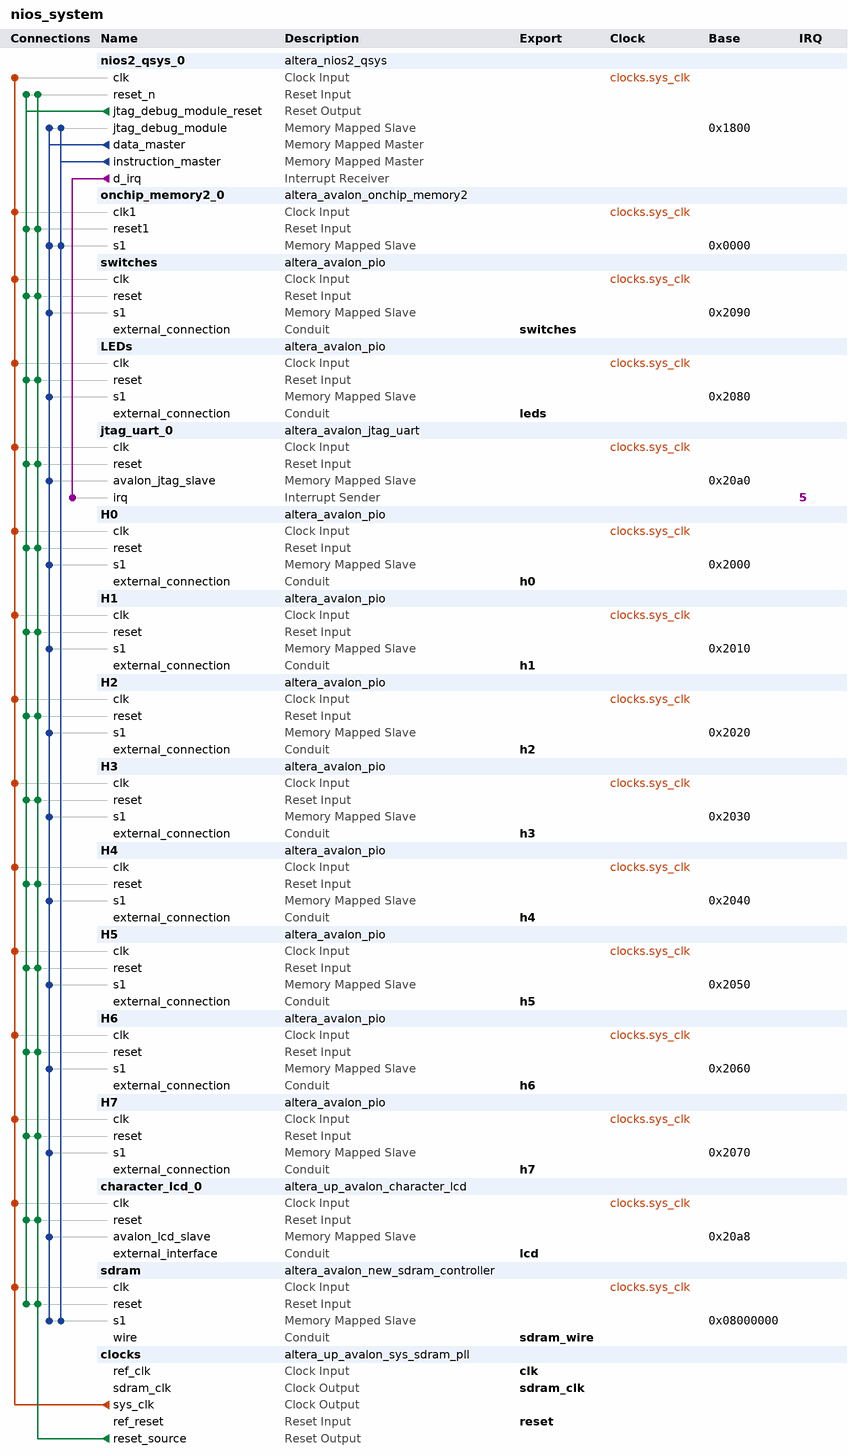
[diagram p0: system contents]
# Platform Designer (Qsys) system nios_system, Cyclone IV E EP4CE115F29C7
# Parameters at their usual value, and those the tool derives, are not listed.
package require -exact qsys 18.0
create_system nios_system
set_project_property DEVICE_FAMILY {Cyclone IV E}
set_project_property DEVICE EP4CE115F29C7

add_instance nios2_qsys_0 altera_nios2_qsys 16.1
set_instance_parameter_value nios2_qsys_0 breakSlave nios2_qsys_0.jtag_debug_module
set_instance_parameter_value nios2_qsys_0 exceptionSlave sdram.s1
set_instance_parameter_value nios2_qsys_0 icache_size 4096
set_instance_parameter_value nios2_qsys_0 impl Fast
set_instance_parameter_value nios2_qsys_0 mmu_TLBMissExcSlave None
set_instance_parameter_value nios2_qsys_0 muldiv_divider true
set_instance_parameter_value nios2_qsys_0 resetSlave sdram.s1
set_instance_parameter_value nios2_qsys_0 resetrequest_enabled true

add_instance onchip_memory2_0 altera_avalon_onchip_memory2 18.0
set_instance_parameter_value onchip_memory2_0 dataWidth 32
set_instance_parameter_value onchip_memory2_0 dualPort false
set_instance_parameter_value onchip_memory2_0 initMemContent true
set_instance_parameter_value onchip_memory2_0 initializationFileName onchip_mem.hex
set_instance_parameter_value onchip_memory2_0 memorySize 4096

add_instance switches altera_avalon_pio 18.0
set_instance_parameter_value switches direction Input
set_instance_parameter_value switches simDoTestBenchWiring true
set_instance_parameter_value switches width 8

add_instance LEDs altera_avalon_pio 18.0
set_instance_parameter_value LEDs direction Output
set_instance_parameter_value LEDs width 8

add_instance jtag_uart_0 altera_avalon_jtag_uart 18.0
set_instance_parameter_value jtag_uart_0 simInteractiveOptions NO_INTERACTIVE_WINDOWS

add_instance H0 altera_avalon_pio 18.0
set_instance_parameter_value H0 direction Output
set_instance_parameter_value H0 width 8

add_instance H1 altera_avalon_pio 18.0
set_instance_parameter_value H1 direction Output
set_instance_parameter_value H1 width 8

add_instance H2 altera_avalon_pio 18.0
set_instance_parameter_value H2 direction Output
set_instance_parameter_value H2 width 8

add_instance H3 altera_avalon_pio 18.0
set_instance_parameter_value H3 direction Output
set_instance_parameter_value H3 width 8

add_instance H4 altera_avalon_pio 18.0
set_instance_parameter_value H4 direction Output
set_instance_parameter_value H4 width 8

add_instance H5 altera_avalon_pio 18.0
set_instance_parameter_value H5 direction Output
set_instance_parameter_value H5 width 8

add_instance H6 altera_avalon_pio 18.0
set_instance_parameter_value H6 direction Output
set_instance_parameter_value H6 width 8

add_instance H7 altera_avalon_pio 18.0
set_instance_parameter_value H7 direction Output
set_instance_parameter_value H7 width 8

add_instance character_lcd_0 altera_up_avalon_character_lcd 18.0
set_instance_parameter_value character_lcd_0 cursor Normal

add_instance sdram altera_avalon_new_sdram_controller 18.0
set_instance_parameter_value sdram TAC 5.5
set_instance_parameter_value sdram TRCD 20.0
set_instance_parameter_value sdram TRP 20.0
set_instance_parameter_value sdram casLatency 3
set_instance_parameter_value sdram columnWidth 10
set_instance_parameter_value sdram dataWidth 32
set_instance_parameter_value sdram generateSimulationModel false
set_instance_parameter_value sdram model single_Micron_MT48LC4M32B2_7_chip
set_instance_parameter_value sdram numberOfBanks 4
set_instance_parameter_value sdram numberOfChipSelects 1
set_instance_parameter_value sdram powerUpDelay 200.0
set_instance_parameter_value sdram refreshPeriod 7.8125
set_instance_parameter_value sdram rowWidth 13

add_instance clocks altera_up_avalon_sys_sdram_pll 18.0
set_instance_parameter_value clocks CV_boards DE10-Standard
set_instance_parameter_value clocks gui_outclk 50.0
set_instance_parameter_value clocks gui_refclk 50.0

# connections
add_connection clocks.sys_clk character_lcd_0.clk clock
add_connection clocks.sys_clk H0.clk clock
add_connection clocks.sys_clk H1.clk clock
add_connection clocks.sys_clk H2.clk clock
add_connection clocks.sys_clk H3.clk clock
add_connection clocks.sys_clk H4.clk clock
add_connection clocks.sys_clk H5.clk clock
add_connection clocks.sys_clk H6.clk clock
add_connection clocks.sys_clk H7.clk clock
add_connection clocks.sys_clk jtag_uart_0.clk clock
add_connection clocks.sys_clk LEDs.clk clock
add_connection clocks.sys_clk nios2_qsys_0.clk clock
add_connection clocks.sys_clk onchip_memory2_0.clk1 clock
add_connection clocks.sys_clk sdram.clk clock
add_connection clocks.sys_clk switches.clk clock
add_connection clocks.reset_source character_lcd_0.reset reset
add_connection clocks.reset_source H0.reset reset
add_connection clocks.reset_source H1.reset reset
add_connection clocks.reset_source H2.reset reset
add_connection clocks.reset_source H3.reset reset
add_connection clocks.reset_source H4.reset reset
add_connection clocks.reset_source H5.reset reset
add_connection clocks.reset_source H6.reset reset
add_connection clocks.reset_source H7.reset reset
add_connection clocks.reset_source jtag_uart_0.reset reset
add_connection clocks.reset_source LEDs.reset reset
add_connection clocks.reset_source nios2_qsys_0.reset_n reset
add_connection clocks.reset_source onchip_memory2_0.reset1 reset
add_connection clocks.reset_source sdram.reset reset
add_connection clocks.reset_source switches.reset reset
add_connection nios2_qsys_0.jtag_debug_module_reset character_lcd_0.reset reset
add_connection nios2_qsys_0.jtag_debug_module_reset H0.reset reset
add_connection nios2_qsys_0.jtag_debug_module_reset H1.reset reset
add_connection nios2_qsys_0.jtag_debug_module_reset H2.reset reset
add_connection nios2_qsys_0.jtag_debug_module_reset H3.reset reset
add_connection nios2_qsys_0.jtag_debug_module_reset H4.reset reset
add_connection nios2_qsys_0.jtag_debug_module_reset H5.reset reset
add_connection nios2_qsys_0.jtag_debug_module_reset H6.reset reset
add_connection nios2_qsys_0.jtag_debug_module_reset H7.reset reset
add_connection nios2_qsys_0.jtag_debug_module_reset jtag_uart_0.reset reset
add_connection nios2_qsys_0.jtag_debug_module_reset LEDs.reset reset
add_connection nios2_qsys_0.jtag_debug_module_reset nios2_qsys_0.reset_n reset
add_connection nios2_qsys_0.jtag_debug_module_reset onchip_memory2_0.reset1 reset
add_connection nios2_qsys_0.jtag_debug_module_reset sdram.reset reset
add_connection nios2_qsys_0.jtag_debug_module_reset switches.reset reset
add_connection nios2_qsys_0.data_master character_lcd_0.avalon_lcd_slave avalon
set_connection_parameter_value nios2_qsys_0.data_master/character_lcd_0.avalon_lcd_slave baseAddress 0x20a8
add_connection nios2_qsys_0.data_master H0.s1 avalon
set_connection_parameter_value nios2_qsys_0.data_master/H0.s1 baseAddress 0x2000
add_connection nios2_qsys_0.data_master H1.s1 avalon
set_connection_parameter_value nios2_qsys_0.data_master/H1.s1 baseAddress 0x2010
add_connection nios2_qsys_0.data_master H2.s1 avalon
set_connection_parameter_value nios2_qsys_0.data_master/H2.s1 baseAddress 0x2020
add_connection nios2_qsys_0.data_master H3.s1 avalon
set_connection_parameter_value nios2_qsys_0.data_master/H3.s1 baseAddress 0x2030
add_connection nios2_qsys_0.data_master H4.s1 avalon
set_connection_parameter_value nios2_qsys_0.data_master/H4.s1 baseAddress 0x2040
add_connection nios2_qsys_0.data_master H5.s1 avalon
set_connection_parameter_value nios2_qsys_0.data_master/H5.s1 baseAddress 0x2050
add_connection nios2_qsys_0.data_master H6.s1 avalon
set_connection_parameter_value nios2_qsys_0.data_master/H6.s1 baseAddress 0x2060
add_connection nios2_qsys_0.data_master H7.s1 avalon
set_connection_parameter_value nios2_qsys_0.data_master/H7.s1 baseAddress 0x2070
add_connection nios2_qsys_0.data_master jtag_uart_0.avalon_jtag_slave avalon
set_connection_parameter_value nios2_qsys_0.data_master/jtag_uart_0.avalon_jtag_slave baseAddress 0x20a0
add_connection nios2_qsys_0.data_master LEDs.s1 avalon
set_connection_parameter_value nios2_qsys_0.data_master/LEDs.s1 baseAddress 0x2080
add_connection nios2_qsys_0.data_master nios2_qsys_0.jtag_debug_module avalon
set_connection_parameter_value nios2_qsys_0.data_master/nios2_qsys_0.jtag_debug_module baseAddress 0x1800
add_connection nios2_qsys_0.data_master onchip_memory2_0.s1 avalon
set_connection_parameter_value nios2_qsys_0.data_master/onchip_memory2_0.s1 baseAddress 0x0000
add_connection nios2_qsys_0.data_master sdram.s1 avalon
set_connection_parameter_value nios2_qsys_0.data_master/sdram.s1 baseAddress 0x08000000
add_connection nios2_qsys_0.data_master switches.s1 avalon
set_connection_parameter_value nios2_qsys_0.data_master/switches.s1 baseAddress 0x2090
add_connection nios2_qsys_0.instruction_master nios2_qsys_0.jtag_debug_module avalon
set_connection_parameter_value nios2_qsys_0.instruction_master/nios2_qsys_0.jtag_debug_module baseAddress 0x1800
add_connection nios2_qsys_0.instruction_master onchip_memory2_0.s1 avalon
set_connection_parameter_value nios2_qsys_0.instruction_master/onchip_memory2_0.s1 baseAddress 0x0000
add_connection nios2_qsys_0.instruction_master sdram.s1 avalon
set_connection_parameter_value nios2_qsys_0.instruction_master/sdram.s1 baseAddress 0x08000000
add_connection nios2_qsys_0.d_irq jtag_uart_0.irq interrupt
set_connection_parameter_value nios2_qsys_0.d_irq/jtag_uart_0.irq irqNumber 5

# exported interfaces
add_interface clk clock sink
set_interface_property clk EXPORT_OF clocks.ref_clk
add_interface h0 conduit end
set_interface_property h0 EXPORT_OF H0.external_connection
add_interface h1 conduit end
set_interface_property h1 EXPORT_OF H1.external_connection
add_interface h2 conduit end
set_interface_property h2 EXPORT_OF H2.external_connection
add_interface h3 conduit end
set_interface_property h3 EXPORT_OF H3.external_connection
add_interface h4 conduit end
set_interface_property h4 EXPORT_OF H4.external_connection
add_interface h5 conduit end
set_interface_property h5 EXPORT_OF H5.external_connection
add_interface h6 conduit end
set_interface_property h6 EXPORT_OF H6.external_connection
add_interface h7 conduit end
set_interface_property h7 EXPORT_OF H7.external_connection
add_interface lcd conduit end
set_interface_property lcd EXPORT_OF character_lcd_0.external_interface
add_interface leds conduit end
set_interface_property leds EXPORT_OF LEDs.external_connection
add_interface reset reset sink
set_interface_property reset EXPORT_OF clocks.ref_reset
add_interface sdram_clk clock source
set_interface_property sdram_clk EXPORT_OF clocks.sdram_clk
add_interface sdram_wire conduit end
set_interface_property sdram_wire EXPORT_OF sdram.wire
add_interface switches conduit end
set_interface_property switches EXPORT_OF switches.external_connection

set_interconnect_requirement {$system} qsys_mm.clockCrossingAdapter HANDSHAKE
set_interconnect_requirement {$system} qsys_mm.enableEccProtection FALSE
set_interconnect_requirement {$system} qsys_mm.insertDefaultSlave FALSE
set_interconnect_requirement {$system} qsys_mm.maxAdditionalLatency 1

save_system nios_system.qsys
